# Altium schematic sheet USB-I2C_Schematic.SchDoc: USB-I2C
size 420 x 297 mm; ApprovedBy: Рогов; CheckedBy: Королев Д.М.; DrawnBy: Тришин В.М.; DocumentNumber: Введите номер платы + Э3; SheetTotal: 1; DocumentType: Электрическая принципиальная; Format: A3; ImagePath: Введите номер платы
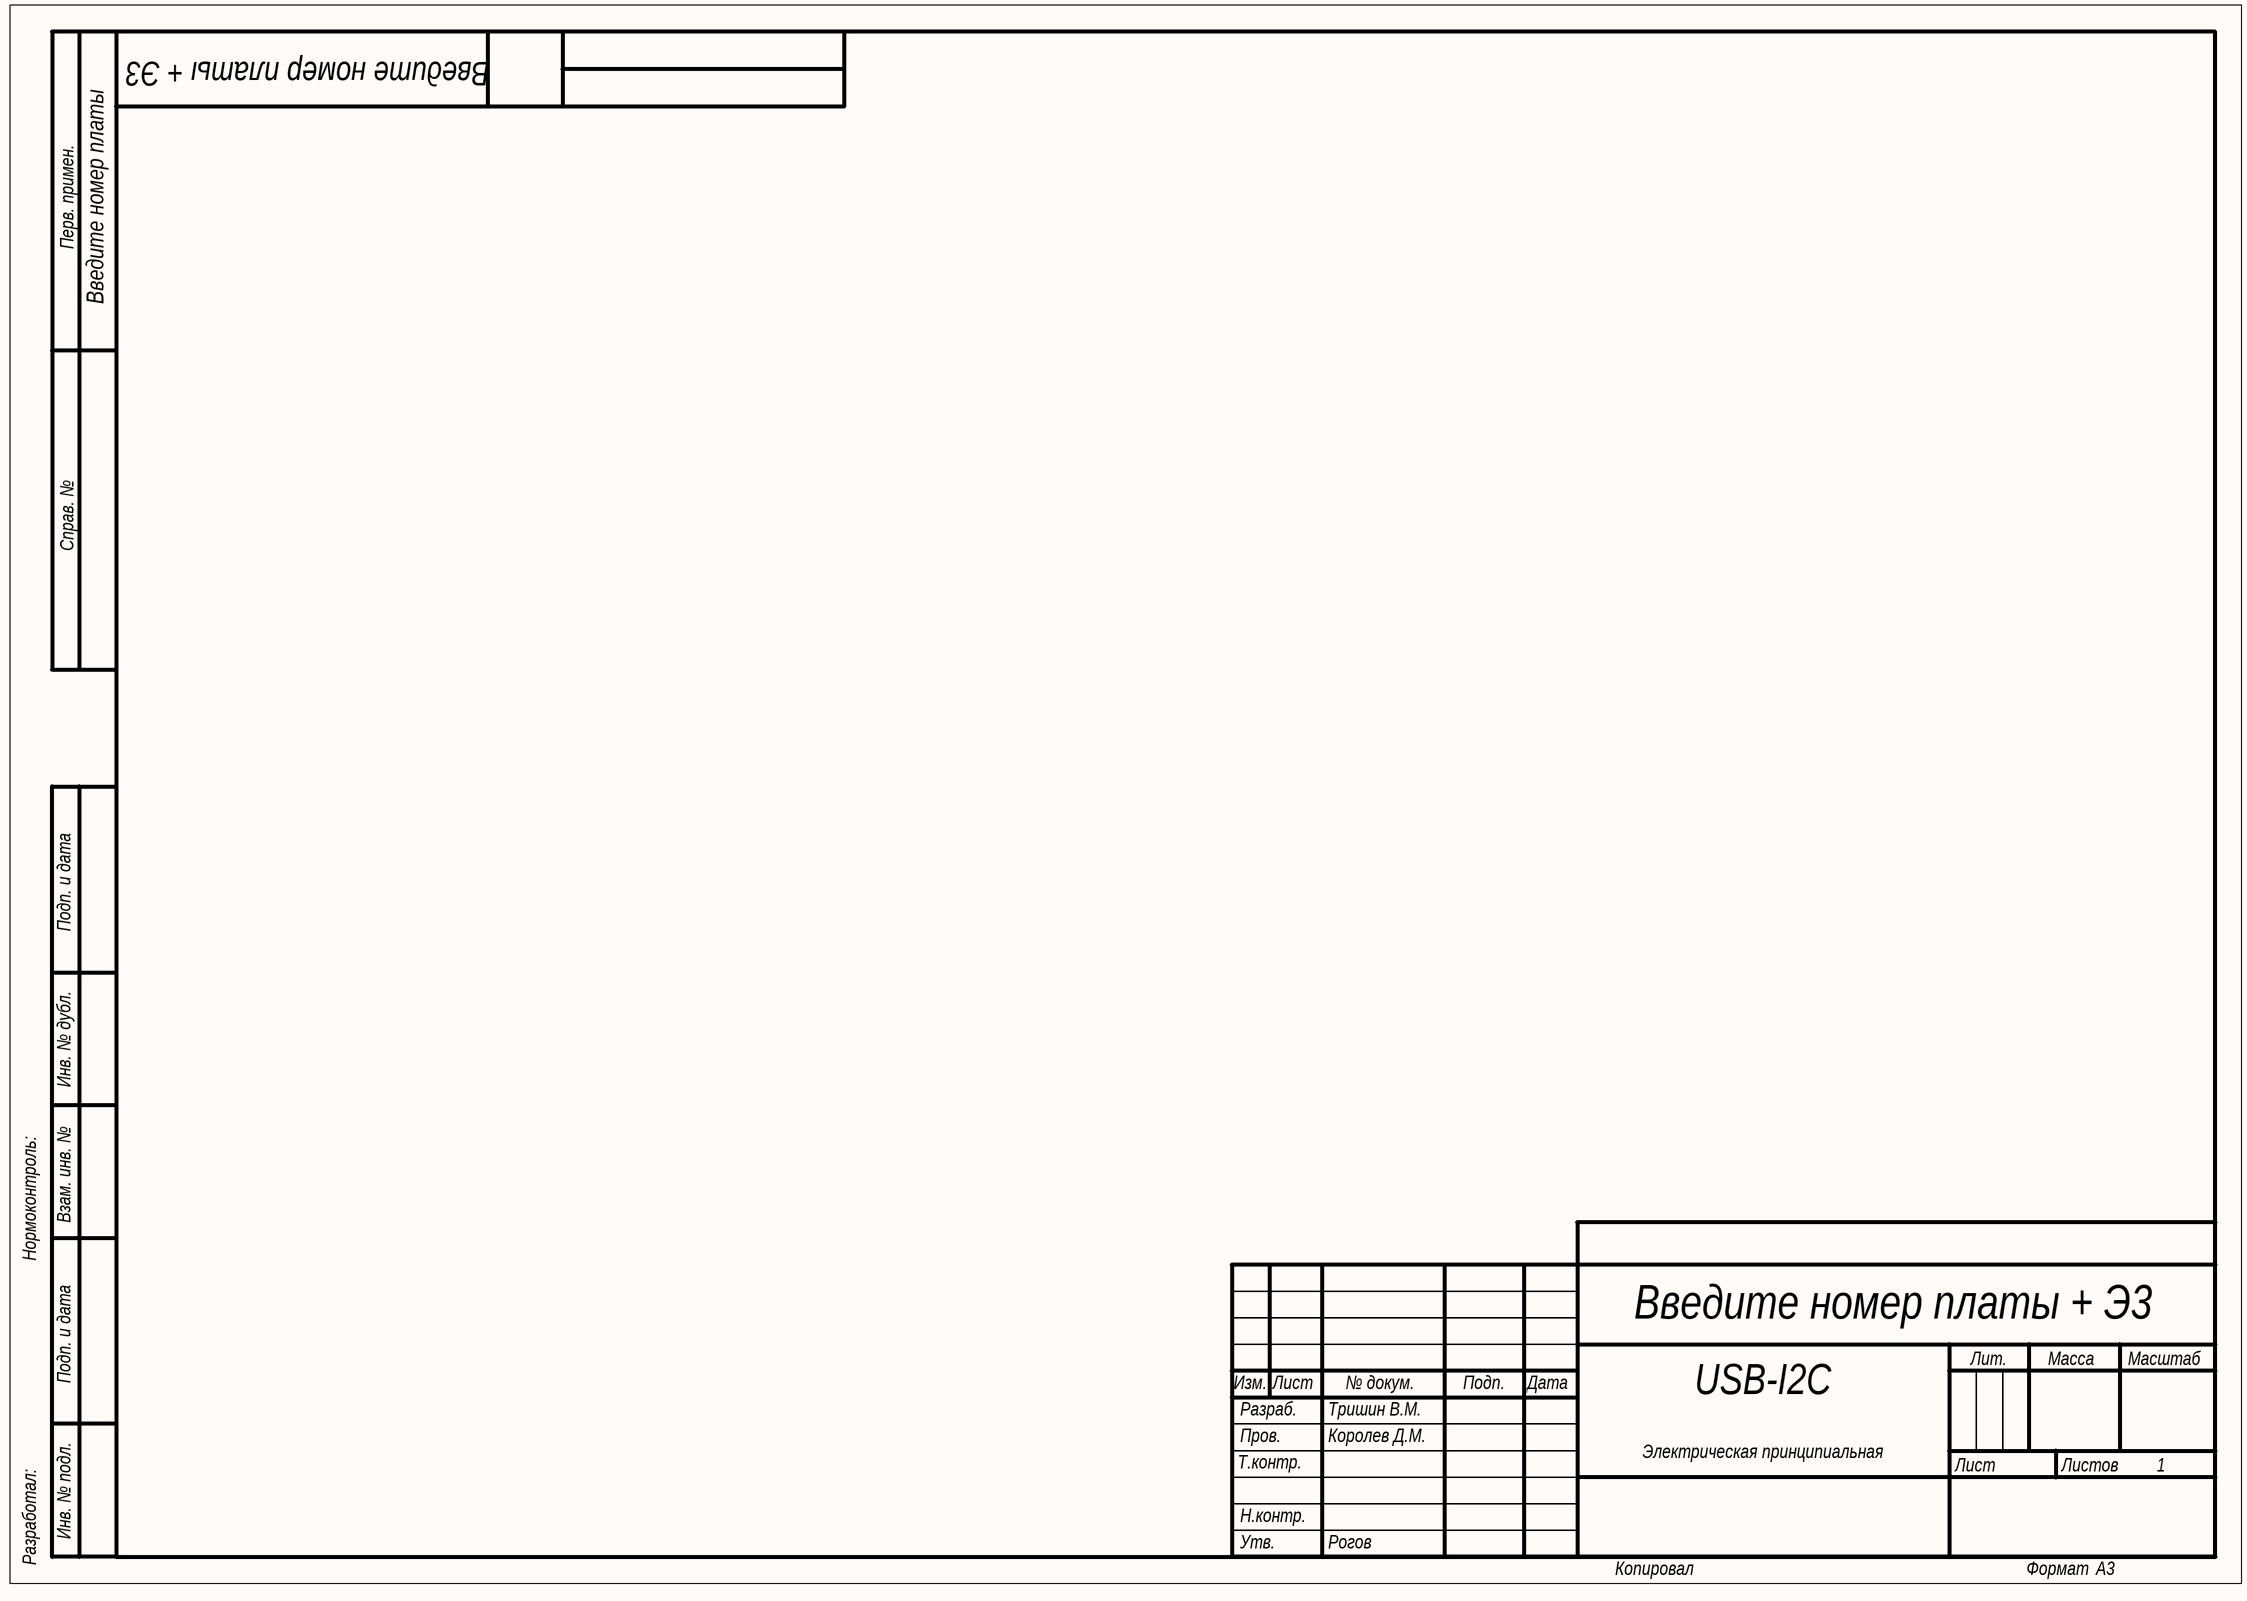
[diagram p0: USB-I2C_Schematic.SchDoc]

## Notes on the sheet
- Перв. примен.
- Справ. №
- Подп. и дата
- Инв. № дубл.
- Нормоконтроль:
- Взам. инв. №
- Изм.
- Лист
- № докум.
- Подп.
- Дата
- Лит.
- Масса
- Масштаб
- Т.контр.
- Пров.
- Разраб.
- Листов
- Разработал:
- Инв. № подл.
- Н.контр.
- Утв.
- Копировал
- Формат